# EAGLE design FM1608-6116-adaptor (EAGLE 7.7.0)
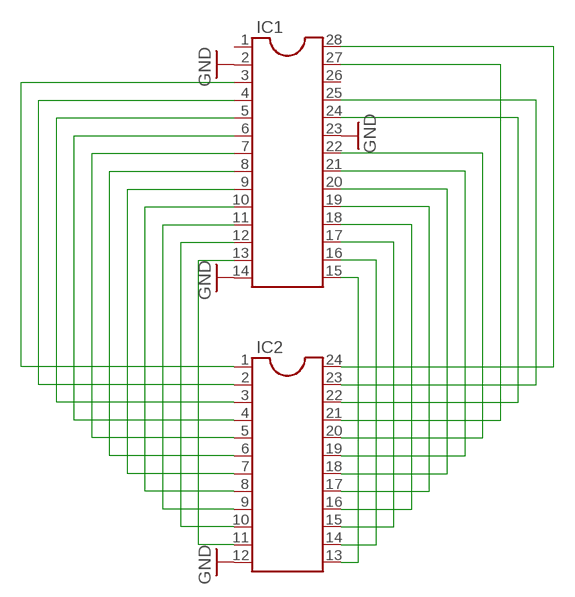
[diagram p0: schematic, sheet 1]

## Parts
IC1  DIL28  [DIL28-6]
IC2  DIL24-6  [DIL24-6]

## Nets
GND: IC1.2 IC1.14 IC1.23 IC2.12
N$1: IC1.15 IC2.13
N$2: IC1.16 IC2.14
N$3: IC1.17 IC2.15
N$4: IC1.18 IC2.16
N$5: IC1.19 IC2.17
N$6: IC1.20 IC2.18
N$7: IC1.21 IC2.19
N$8: IC1.22 IC2.20
N$9: IC1.13 IC2.11
N$10: IC1.12 IC2.10
N$11: IC1.11 IC2.9
N$12: IC1.10 IC2.8
N$13: IC1.9 IC2.7
N$14: IC1.8 IC2.6
N$15: IC1.7 IC2.5
N$16: IC1.6 IC2.4
N$17: IC1.5 IC2.3
N$18: IC1.4 IC2.2
N$19: IC1.3 IC2.1
N$20: IC1.27 IC2.21
N$21: IC1.24 IC2.22
N$22: IC1.25 IC2.23
N$23: IC1.28 IC2.24
Unconnected: IC1.1 IC1.26

## Library data of the parts
IC1 = ic-package:DIL28: Dual In Line
IC2 = ic-package:DIL24: Dual In Line

## Board
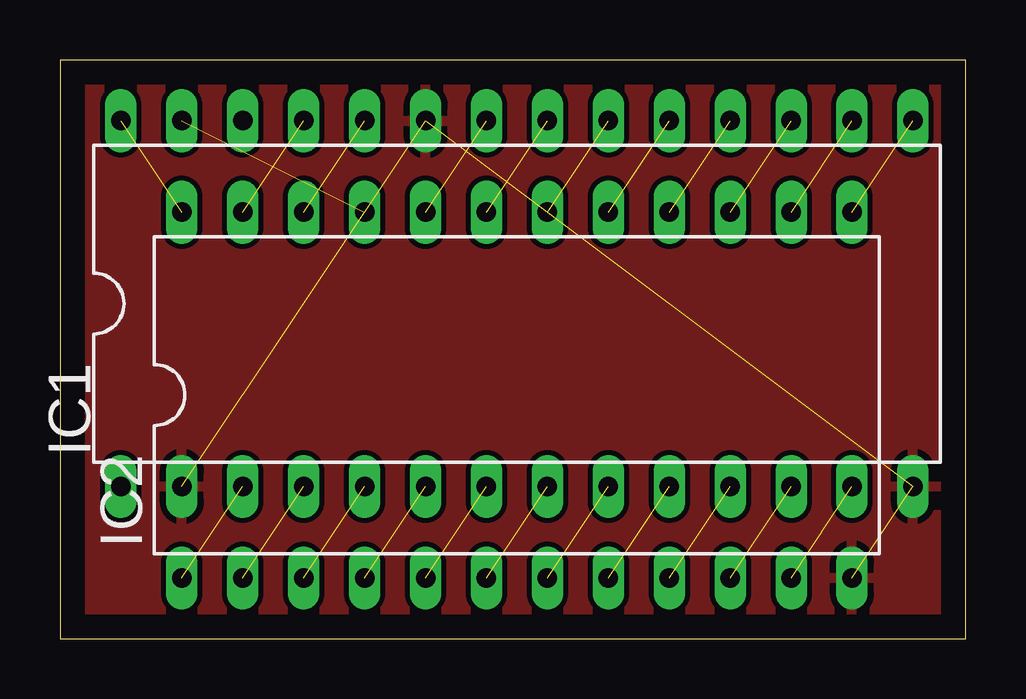
[diagram p1: board, top side]
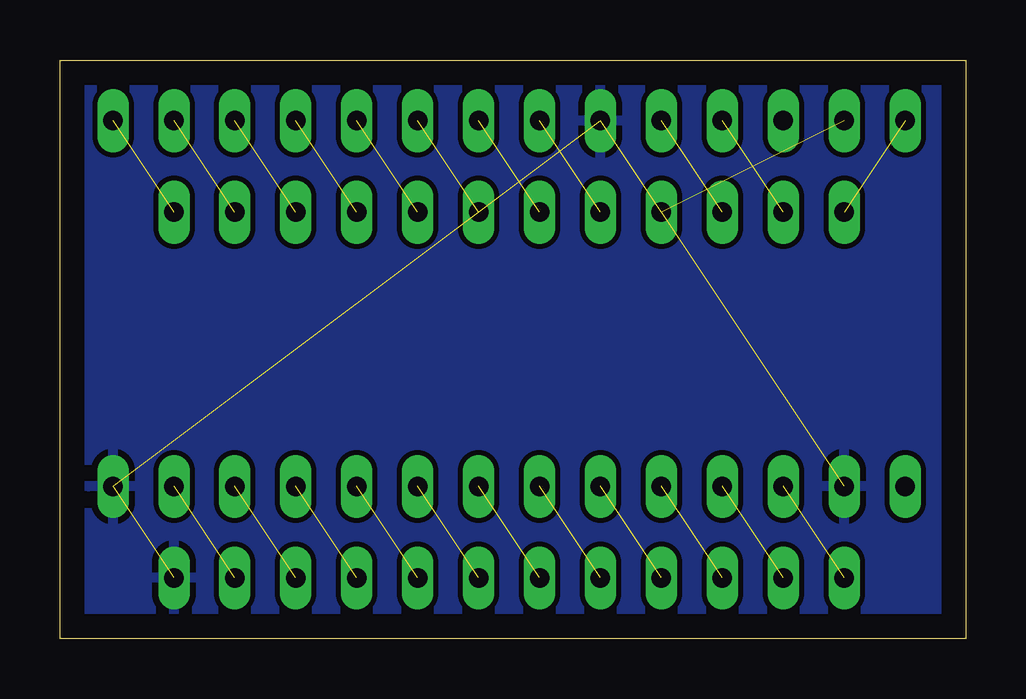
[diagram p2: board, bottom side, seen from below]

Size 37.77 x 24.12 mm. Coordinates in mm from the lower left corner, seen from the top.
Outline: 0,0 37.77,0 37.77,24.12 0,24.12 0,0
Copper layers (1*16): Top 0.035mm / dielectric 1.5mm / Bottom 0.035mm
Design rules "default": minimum track width 10mil, minimum drill 24mil, track to track 8mil, track to pad 8mil, pad to pad 8mil, via to via 8mil, smd to smd 8mil, copper to edge 40mil, drill to drill 8mil, minimum pad ring 10mil, minimum via ring 8mil, stop-mask expansion 4mil, vias tented up to drill 0mil, thermal gap 10mil

### Footprints (pad centres in the part's own frame; a part is rotated, then mirrored left to right if it is on the bottom)
DIL28-6 = drill 0.813 long: 1 -16.51,-7.62; 2 -13.97,-7.62; 3 -11.43,-7.62; 4 -8.89,-7.62; 5 -6.35,-7.62; 6 -3.81,-7.62; 7 -1.27,-7.62; 8 1.27,-7.62; 9 3.81,-7.62; 10 6.35,-7.62; 11 8.89,-7.62; 12 11.43,-7.62; 13 13.97,-7.62; 14 16.51,-7.62; 15 16.51,7.62; 16 13.97,7.62; 17 11.43,7.62; 18 8.89,7.62; 19 6.35,7.62; 20 3.81,7.62; 21 1.27,7.62; 22 -1.27,7.62; 23 -3.81,7.62; 24 -6.35,7.62; 25 -8.89,7.62; 26 -11.43,7.62; 27 -13.97,7.62; 28 -16.51,7.62
DIL24-6 = drill 0.813 long: 1 -13.97,-7.62; 2 -11.43,-7.62; 3 -8.89,-7.62; 4 -6.35,-7.62; 5 -3.81,-7.62; 6 -1.27,-7.62; 7 1.27,-7.62; 8 3.81,-7.62; 9 6.35,-7.62; 10 8.89,-7.62; 11 11.43,-7.62; 12 13.97,-7.62; 13 13.97,7.62; 14 11.43,7.62; 15 8.89,7.62; 16 6.35,7.62; 17 3.81,7.62; 18 1.27,7.62; 19 -1.27,7.62; 20 -3.81,7.62; 21 -6.35,7.62; 22 -8.89,7.62; 23 -11.43,7.62; 24 -13.97,7.62

### Placement (x,y rotation side)
IC1  19.05,13.97 0 top
IC2  19.05,10.16 0 top

### Tracks (layer width: path | path; a pad name or v marks a point on that pad's centre or on a via)
GND  (3 unrouted)
  pour Top: -1.27,25.4 -1.27,-2.54 40.64,-2.54 40.64,25.4
  pour Bottom: -2.54,26.67 -2.54,-1.27 39.37,-1.27 39.37,26.67
N$1  (1 unrouted)
N$2  (1 unrouted)
N$3  (1 unrouted)
N$4  (1 unrouted)
N$5  (1 unrouted)
N$6  (1 unrouted)
N$7  (1 unrouted)
N$8  (1 unrouted)
N$9  (1 unrouted)
N$10  (1 unrouted)
N$11  (1 unrouted)
N$12  (1 unrouted)
N$13  (1 unrouted)
N$14  (1 unrouted)
N$15  (1 unrouted)
N$16  (1 unrouted)
N$17  (1 unrouted)
N$18  (1 unrouted)
N$19  (1 unrouted)
N$20  (1 unrouted)
N$21  (1 unrouted)
N$22  (1 unrouted)
N$23  (1 unrouted)